# EAGLE design hail-debug (EAGLE 8.0.2)
AUTHOR: Brad Campbell; REV: A; TITLE: Hail Debug Board
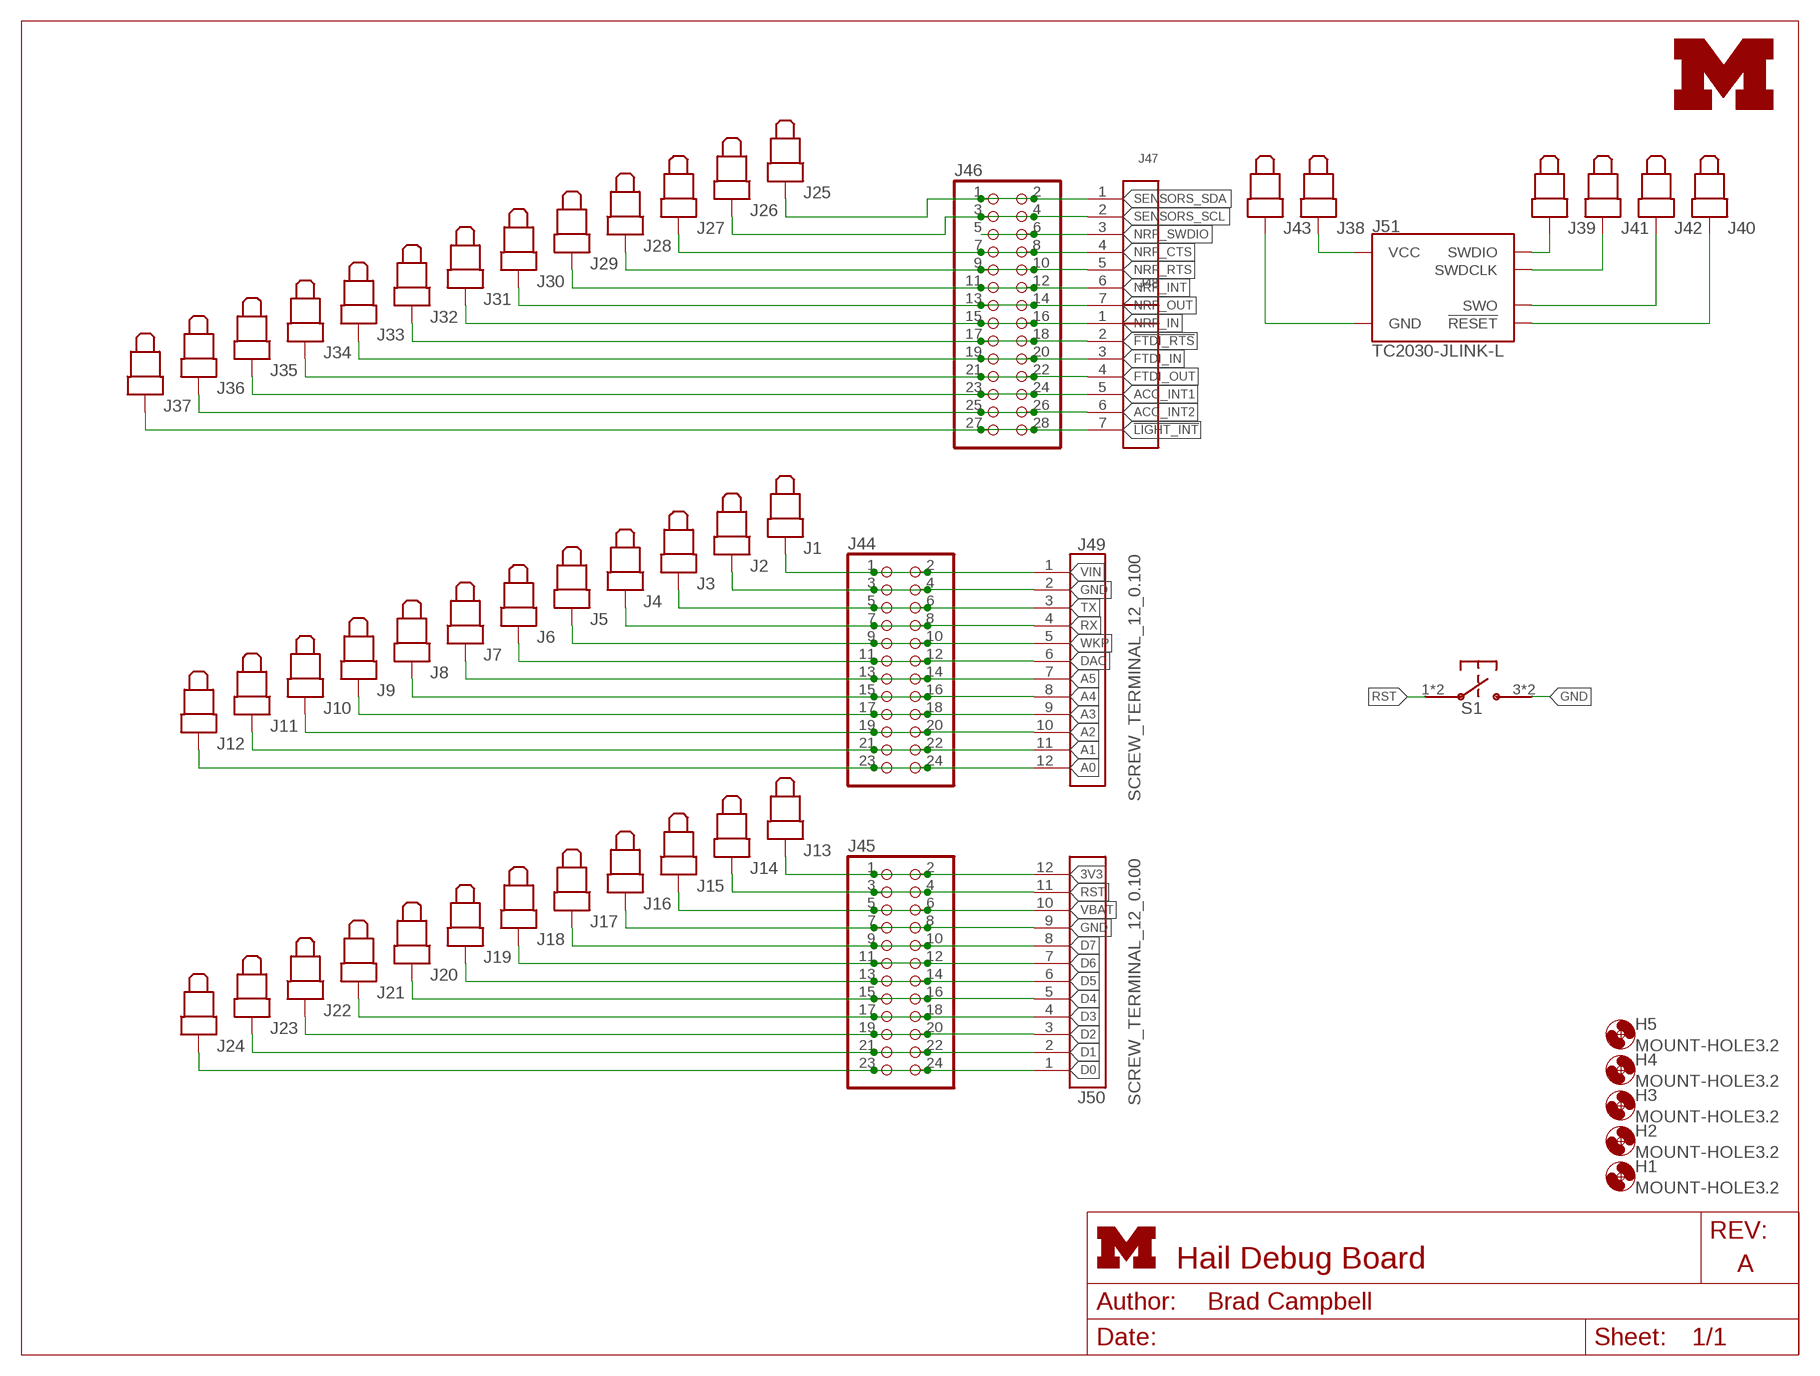
[diagram p0: schematic, sheet 1]
FRAME1 (LETTER_L_UMICH): HEIGHT: 8.5in; WIDTH: 11in

## Parts
H1  MOUNT-HOLE3.2  [3,2]
H2  MOUNT-HOLE3.2  [3,2]
H3  MOUNT-HOLE3.2  [3,2]
H4  MOUNT-HOLE3.2  [3,2]
H5  MOUNT-HOLE3.2  [3,2]
J1  MILLMAX_0908-X-15-20-75-14-11-0  [POGO_0908-X-15-20-75-14-11-0]
J2  MILLMAX_0908-X-15-20-75-14-11-0  [POGO_0908-X-15-20-75-14-11-0]
J3  MILLMAX_0908-X-15-20-75-14-11-0  [POGO_0908-X-15-20-75-14-11-0]
J4  MILLMAX_0908-X-15-20-75-14-11-0  [POGO_0908-X-15-20-75-14-11-0]
J5  MILLMAX_0908-X-15-20-75-14-11-0  [POGO_0908-X-15-20-75-14-11-0]
J6  MILLMAX_0908-X-15-20-75-14-11-0  [POGO_0908-X-15-20-75-14-11-0]
J7  MILLMAX_0908-X-15-20-75-14-11-0  [POGO_0908-X-15-20-75-14-11-0]
J8  MILLMAX_0908-X-15-20-75-14-11-0  [POGO_0908-X-15-20-75-14-11-0]
J9  MILLMAX_0908-X-15-20-75-14-11-0  [POGO_0908-X-15-20-75-14-11-0]
J10  MILLMAX_0908-X-15-20-75-14-11-0  [POGO_0908-X-15-20-75-14-11-0]
J11  MILLMAX_0908-X-15-20-75-14-11-0  [POGO_0908-X-15-20-75-14-11-0]
J12  MILLMAX_0908-X-15-20-75-14-11-0  [POGO_0908-X-15-20-75-14-11-0]
J13  MILLMAX_0908-X-15-20-75-14-11-0  [POGO_0908-X-15-20-75-14-11-0]
J14  MILLMAX_0908-X-15-20-75-14-11-0  [POGO_0908-X-15-20-75-14-11-0]
J15  MILLMAX_0908-X-15-20-75-14-11-0  [POGO_0908-X-15-20-75-14-11-0]
J16  MILLMAX_0908-X-15-20-75-14-11-0  [POGO_0908-X-15-20-75-14-11-0]
J17  MILLMAX_0908-X-15-20-75-14-11-0  [POGO_0908-X-15-20-75-14-11-0]
J18  MILLMAX_0908-X-15-20-75-14-11-0  [POGO_0908-X-15-20-75-14-11-0]
J19  MILLMAX_0908-X-15-20-75-14-11-0  [POGO_0908-X-15-20-75-14-11-0]
J20  MILLMAX_0908-X-15-20-75-14-11-0  [POGO_0908-X-15-20-75-14-11-0]
J21  MILLMAX_0908-X-15-20-75-14-11-0  [POGO_0908-X-15-20-75-14-11-0]
J22  MILLMAX_0908-X-15-20-75-14-11-0  [POGO_0908-X-15-20-75-14-11-0]
J23  MILLMAX_0908-X-15-20-75-14-11-0  [POGO_0908-X-15-20-75-14-11-0]
J24  MILLMAX_0908-X-15-20-75-14-11-0  [POGO_0908-X-15-20-75-14-11-0]
J25  MILLMAX_0985-X-15-20-71-14-11-0  [POGO_0985-X-15-20-71-14-11-0]
J26  MILLMAX_0985-X-15-20-71-14-11-0  [POGO_0985-X-15-20-71-14-11-0]
J27  MILLMAX_0985-X-15-20-71-14-11-0  [POGO_0985-X-15-20-71-14-11-0]
J28  MILLMAX_0985-X-15-20-71-14-11-0  [POGO_0985-X-15-20-71-14-11-0]
J29  MILLMAX_0985-X-15-20-71-14-11-0  [POGO_0985-X-15-20-71-14-11-0]
J30  MILLMAX_0985-X-15-20-71-14-11-0  [POGO_0985-X-15-20-71-14-11-0]
J31  MILLMAX_0985-X-15-20-71-14-11-0  [POGO_0985-X-15-20-71-14-11-0]
J32  MILLMAX_0985-X-15-20-71-14-11-0  [POGO_0985-X-15-20-71-14-11-0]
J33  MILLMAX_0985-X-15-20-71-14-11-0  [POGO_0985-X-15-20-71-14-11-0]
J34  MILLMAX_0985-X-15-20-71-14-11-0  [POGO_0985-X-15-20-71-14-11-0]
J35  MILLMAX_0985-X-15-20-71-14-11-0  [POGO_0985-X-15-20-71-14-11-0]
J36  MILLMAX_0985-X-15-20-71-14-11-0  [POGO_0985-X-15-20-71-14-11-0]
J37  MILLMAX_0985-X-15-20-71-14-11-0  [POGO_0985-X-15-20-71-14-11-0]
J38  MILLMAX_0985-X-15-20-71-14-11-0  [POGO_0985-X-15-20-71-14-11-0]
J39  MILLMAX_0985-X-15-20-71-14-11-0  [POGO_0985-X-15-20-71-14-11-0]
J40  MILLMAX_0985-X-15-20-71-14-11-0  [POGO_0985-X-15-20-71-14-11-0]
J41  MILLMAX_0985-X-15-20-71-14-11-0  [POGO_0985-X-15-20-71-14-11-0]
J42  MILLMAX_0985-X-15-20-71-14-11-0  [POGO_0985-X-15-20-71-14-11-0]
J43  MILLMAX_0985-X-15-20-71-14-11-0  [POGO_0985-X-15-20-71-14-11-0]
J44  PINHD-2X12  [2X12]
J45  PINHD-2X12  [2X12]
J46  PINHD-2X14  [2X14]
J47  SCREW-TERMINAL_7_0.100  [CONN_BLOCK_7]
J48  SCREW-TERMINAL_7_0.100  [CONN_BLOCK_7]
J49  SCREW_TERMINAL_12_0.100  [CONN_BLOCK_12]
J50  SCREW_TERMINAL_12_0.100  [CONN_BLOCK_12]
J51  TC2030-JLINK-L  [TC2030-IDC]
LOGO1  UMICH_SOLID_SMALL+  [UMICH_SOLID_100MIL]
S1  PTS645SM43SMTR92  [PTS645]

## Nets
3V3: J13.P$1 J45.1 J45.2 J50.12
!FTDI_RTS: J32.P1 J46.17 J46.18 J48.2
!LIGHT_INT: J37.P1 J46.27 J46.28 J48.7
!NRF_RESET: J40.P1 J51.3(!RESET)
A0: J12.P$1 J44.23 J44.24 J49.12
A1: J11.P$1 J44.21 J44.22 J49.11
A2: J10.P$1 J44.19 J44.20 J49.10
A3: J9.P$1 J44.17 J44.18 J49.9
A4: J8.P$1 J44.15 J44.16 J49.8
A5: J7.P$1 J44.13 J44.14 J49.7
ACC_INT1: J35.P1 J46.23 J46.24 J48.5
ACC_INT2: J36.P1 J46.25 J46.26 J48.6
D0: J24.P$1 J45.23 J45.24 J50.1
D1: J23.P$1 J45.21 J45.22 J50.2
D2: J22.P$1 J45.19 J45.20 J50.3
D3: J21.P$1 J45.17 J45.18 J50.4
D4: J20.P$1 J45.15 J45.16 J50.5
D5: J19.P$1 J45.13 J45.14 J50.6
D6: J18.P$1 J45.11 J45.12 J50.7
D7: J17.P$1 J45.9 J45.10 J50.8
DAC: J6.P$1 J44.11 J44.12 J49.6
FTDI_IN: J33.P1 J46.19 J46.20 J48.3
FTDI_OUT: J34.P1 J46.21 J46.22 J48.4
GND: J2.P$1 J16.P$1 J43.P1 J44.3 J44.4 J45.7 J45.8 J49.2 J50.9 J51.5(GND) S1.3 S1.4
NRF_CTS: J27.P1 J46.7 J46.8 J47.4
NRF_IN: J31.P1 J46.15 J46.16 J48.1
NRF_INT: J29.P1 J46.11 J46.12 J47.6
NRF_OUT: J30.P1 J46.13 J46.14 J47.7
NRF_RTS: J28.P1 J46.9 J46.10 J47.5
NRF_SWDCLK: J41.P1 J51.4(SWDCLK)
NRF_SWDIO: J39.P1 J46.5 J46.6 J47.3 J51.2(SWDIO)
NRF_SWO: J42.P1
NRV_VCC: J38.P1 J51.1(VCC)
RST: J14.P$1 J45.3 J45.4 J50.11 S1.1 S1.2
RX: J4.P$1 J44.7 J44.8 J49.4
SENSORS_SCL: J26.P1 J46.3 J46.4 J47.2
SENSORS_SDA: J25.P1 J46.1 J46.2 J47.1
TX: J3.P$1 J44.5 J44.6 J49.3
VBAT: J15.P$1 J45.5 J45.6 J50.10
VIN: J1.P$1 J44.1 J44.2 J49.1
WKP: J5.P$1 J44.9 J44.10 J49.5
Unconnected: J51.6(SWO)

## Library data of the parts
H1-H5 = holes:MOUNT-HOLE: MOUNTING HOLE with drill center marker
J1-J24 = headers:MILLMAX_0908-X-15-20-75-14-11-0; DIGIKEY: ED90384-ND
J25-J43 = headers:MILLMAX_0985-X-15-20-71-14-11-0; DIGIKEY: ED1122-ND
J44 J45 = pinhead:PINHD-2X12: PIN HEADER; DIGIKEY: S2011EC-12-ND
J46 = pinhead:PINHD-2X14: PIN HEADER; DIGIKEY: S2011EC-14-ND
J47 J48 = headers:SCREW-TERMINAL_7_0.100: 7x 0.100 in screw terminal block; DIGIKEY: 277-1278-ND; MOUSER: 651-1725708; NEWARK: 14X4980
J49 J50 = headers:SCREW_TERMINAL_12_0.100; DIGIKEY: 277-1283-ND
J51 = connector:TC2030-JLINK
LOGO1 = logos:UMICH_SOLID
S1 = switches:PTS645SM43SMTR92: Tactile Switch SPST-NO Top Actuated Surface Mount; DIGIKEY: CKN9112CT-ND

## Board
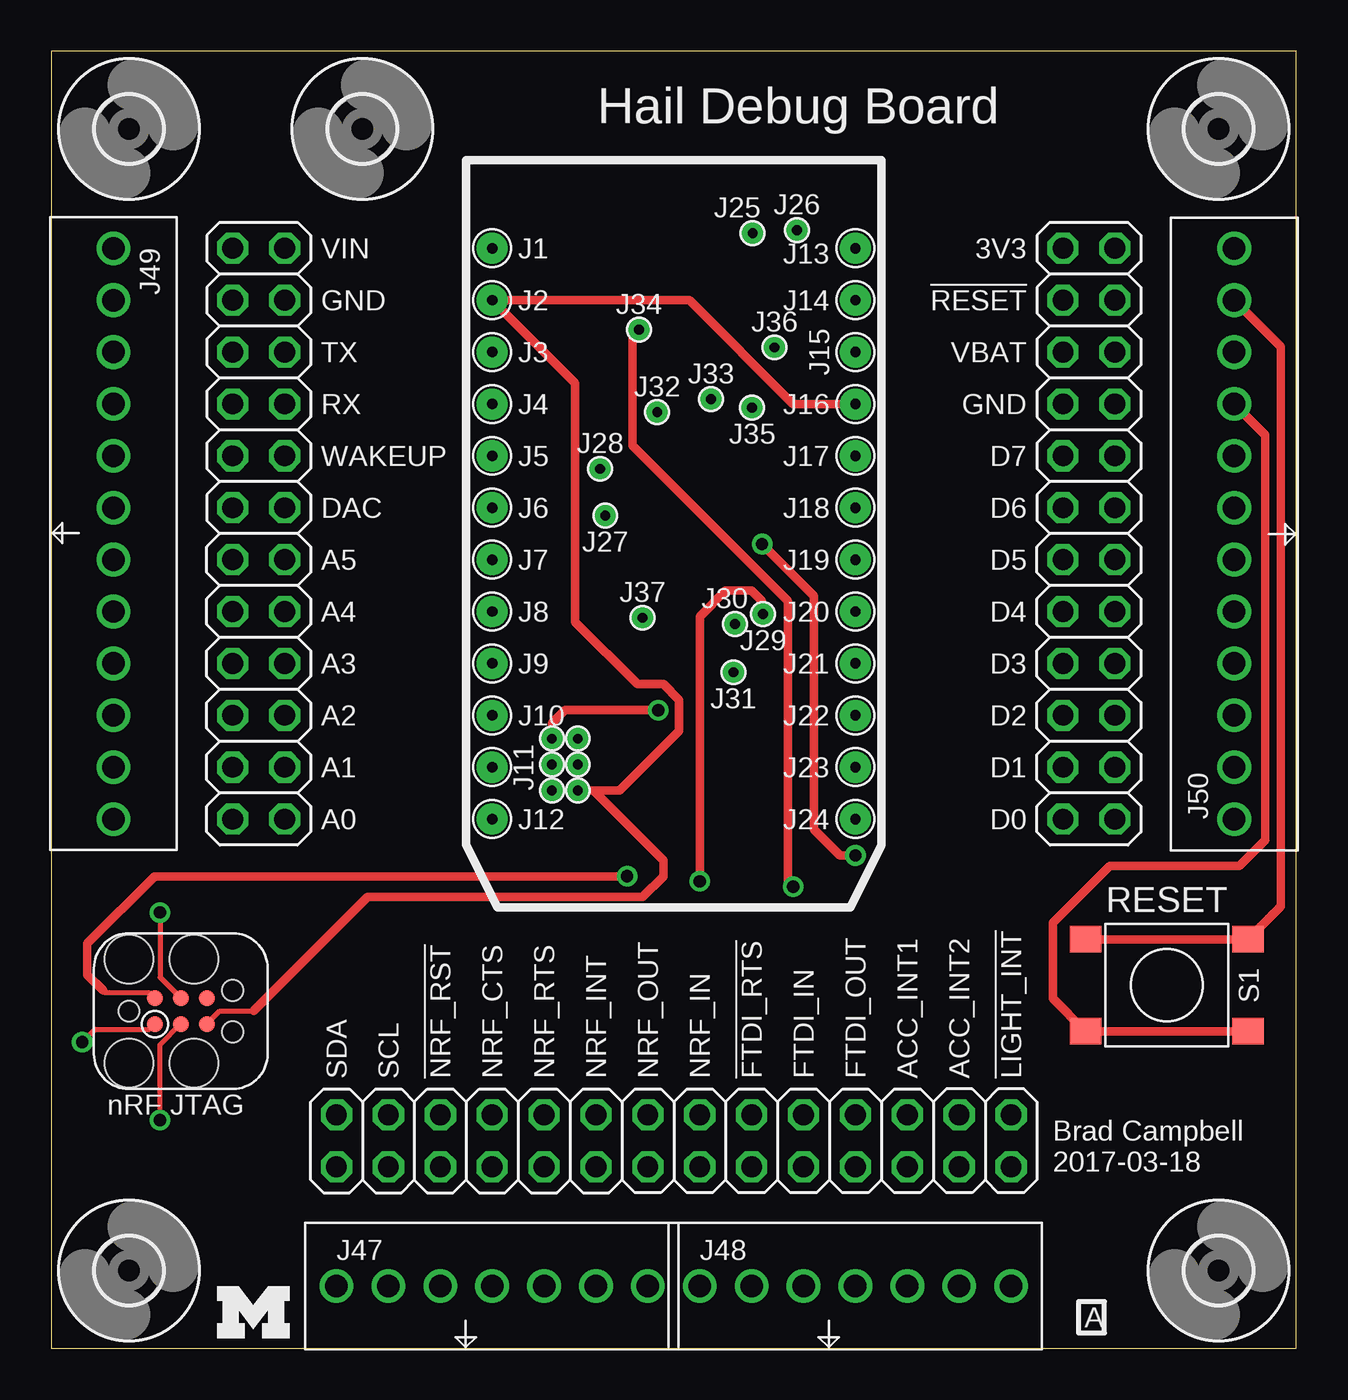
[diagram p1: board, top side]
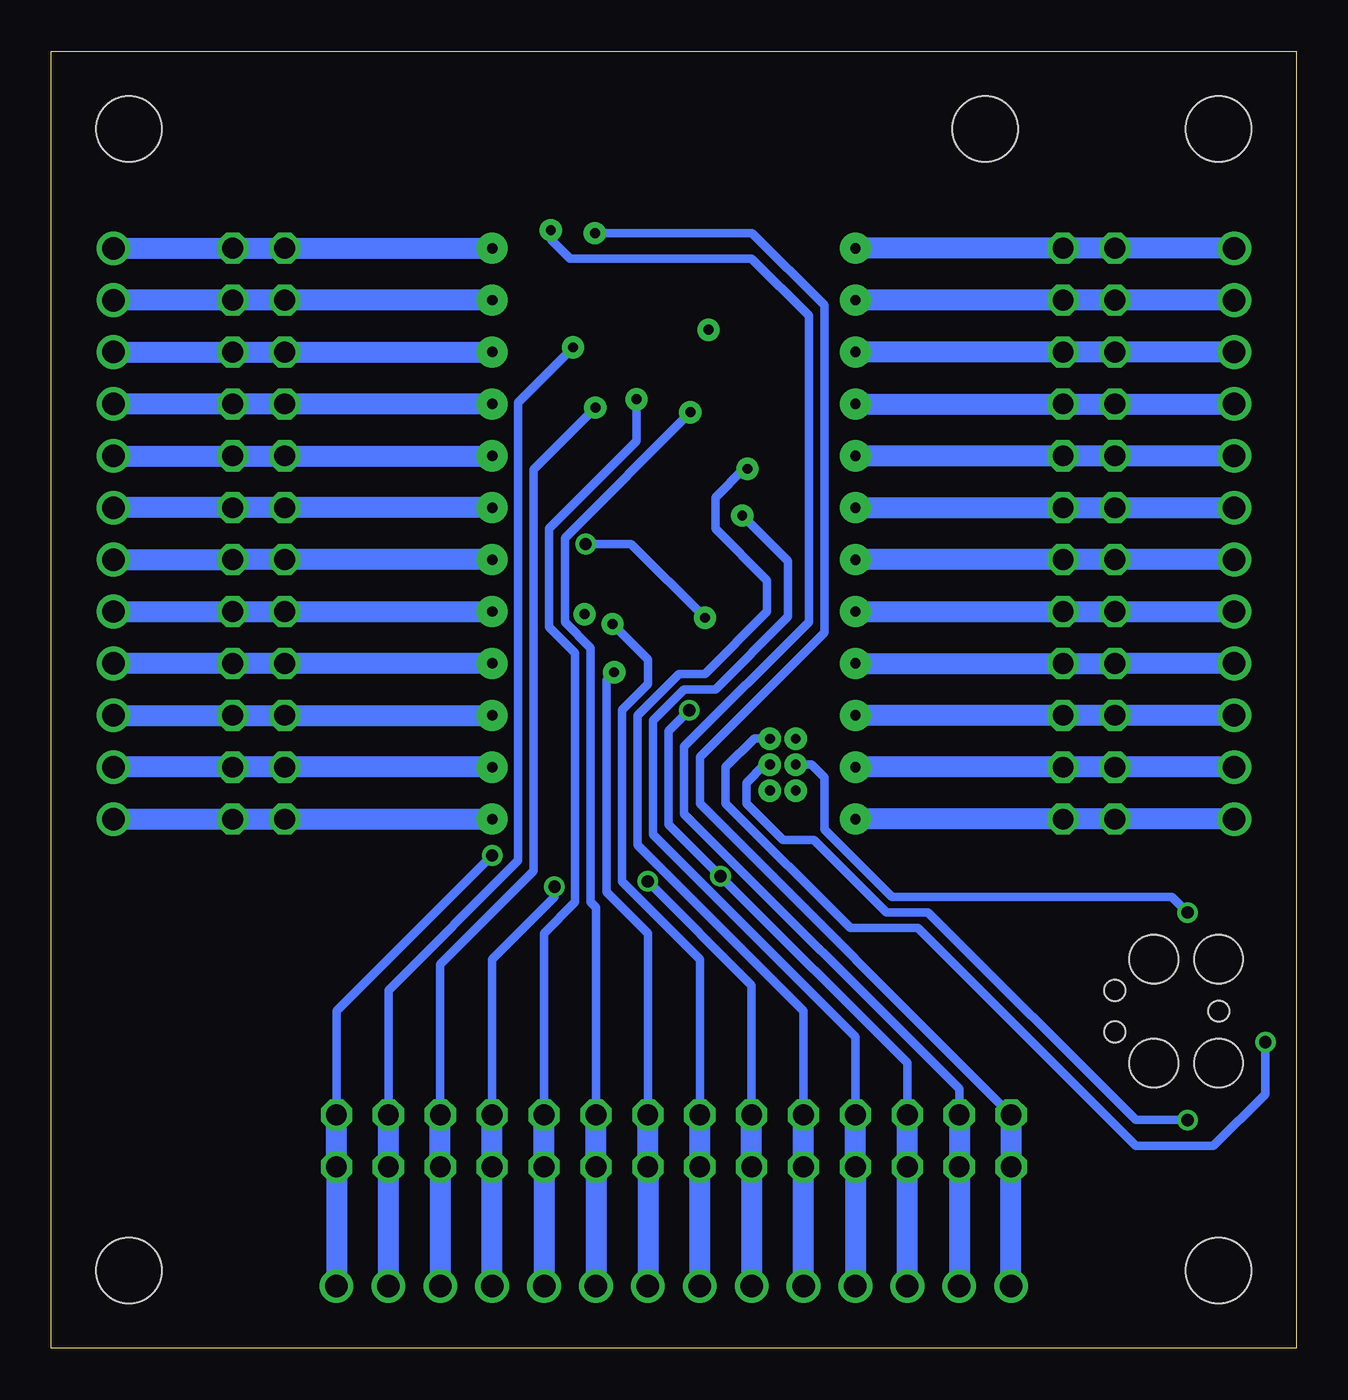
[diagram p2: board, bottom side, seen from below]

Size 60.96 x 63.5 mm. Coordinates in mm from the lower left corner, seen from the top.
Outline: 0,0 60.96,0 60.96,63.5 0,63.5 0,0
Copper layers (1*16): Top 0.0178mm / dielectric 59mil / Bottom 0.0178mm
Design rules "sunstone-2lyr_v1.0.0.3": minimum track width 6mil, minimum drill 14mil, track to track 6mil, track to pad 6mil, pad to pad 6mil, via to via 6mil, smd to smd 6mil, copper to edge 20mil, drill to drill 16mil, minimum pad ring 8mil, minimum via ring 8mil, stop-mask expansion 3mil, vias tented up to drill 50mil, thermal gap 10mil

### Footprints (pad centres in the part's own frame; a part is rotated, then mirrored left to right if it is on the bottom)
3,2 = hole 3.2: 0,0
POGO_0908-X-15-20-75-14-11-0 = drill 0.508 pad 1.524: P$1 0,0
POGO_0985-X-15-20-71-14-11-0 = drill 0.483 pad 1.092: P1 0,0
2X12 = drill 1.016 octagon: 1 -13.97,-1.27; 2 -13.97,1.27; 3 -11.43,-1.27; 4 -11.43,1.27; 5 -8.89,-1.27; 6 -8.89,1.27; 7 -6.35,-1.27; 8 -6.35,1.27; 9 -3.81,-1.27; 10 -3.81,1.27; 11 -1.27,-1.27; 12 -1.27,1.27; 13 1.27,-1.27; 14 1.27,1.27; 15 3.81,-1.27; 16 3.81,1.27; 17 6.35,-1.27; 18 6.35,1.27; 19 8.89,-1.27; 20 8.89,1.27; 21 11.43,-1.27; 22 11.43,1.27; 23 13.97,-1.27; 24 13.97,1.27
2X14 = drill 1.016 octagon: 1 -16.51,-1.27; 2 -16.51,1.27; 3 -13.97,-1.27; 4 -13.97,1.27; 5 -11.43,-1.27; 6 -11.43,1.27; 7 -8.89,-1.27; 8 -8.89,1.27; 9 -6.35,-1.27; 10 -6.35,1.27; 11 -3.81,-1.27; 12 -3.81,1.27; 13 -1.27,-1.27; 14 -1.27,1.27; 15 1.27,-1.27; 16 1.27,1.27; 17 3.81,-1.27; 18 3.81,1.27; 19 6.35,-1.27; 20 6.35,1.27; 21 8.89,-1.27; 22 8.89,1.27; 23 11.43,-1.27; 24 11.43,1.27; 25 13.97,-1.27; 26 13.97,1.27; 27 16.51,-1.27; 28 16.51,1.27
CONN_BLOCK_7 = drill 1.1: 1 -7.62,0; 2 -5.08,0; 3 -2.54,0; 4 0,0; 5 2.54,0; 6 5.08,0; 7 7.62,0
CONN_BLOCK_12 = drill 1.1: 1 -13.97,0; 2 -11.43,0; 3 -8.89,0; 4 -6.35,0; 5 -3.81,0; 6 -1.27,0; 7 1.27,0; 8 3.81,0; 9 6.35,0; 10 8.89,0; 11 11.43,0; 12 13.97,0
TC2030-IDC = smd 0.787 x 0.787: 1 -1.27,-0.635; 2 -1.27,0.635; 3 0,-0.635; 4 0,0.635; 5 1.27,-0.635; 6 1.27,0.635 | hole 2.375: -2.54,2.54; 0.635,2.54; 0.635,-2.54; -2.54,-2.54 | hole 1.016: -2.54,0; 2.54,1.016; 2.54,-1.016
PTS645 = smd 1.55 x 1.3: 1 -3.975,2.25; 2 3.975,2.25; 3 3.975,-2.25; 4 -3.975,-2.25

### Placement (x,y rotation side)
H1  3.81,59.69 0 top
H2  57.15,59.69 0 top
H3  57.15,3.81 0 top
H4  3.81,3.81 0 top
H5  15.24,59.69 0 top
J1  21.59,53.85 0 top
J2  21.59,51.31 0 top
J3  21.59,48.77 0 top
J4  21.59,46.23 0 top
J5  21.59,43.69 0 top
J6  21.59,41.15 0 top
J7  21.59,38.61 0 top
J8  21.59,36.07 0 top
J9  21.59,33.53 0 top
J10  21.59,30.99 0 top
J11  21.59,28.45 0 top
J12  21.59,25.91 0 top
J13  39.37,53.85 0 top
J14  39.37,51.31 0 top
J15  39.37,48.77 0 top
J16  39.37,46.23 0 top
J17  39.37,43.69 0 top
J18  39.37,41.15 0 top
J19  39.37,38.61 0 top
J20  39.37,36.07 0 top
J21  39.37,33.53 0 top
J22  39.37,30.99 0 top
J23  39.37,28.45 0 top
J24  39.37,25.91 0 top
J25  34.34,54.58 0 top
J26  36.5,54.74 0 top
J27  27.13,40.77 0 top
J28  26.87,43.05 0 top
J29  34.85,35.94 0 top
J30  33.48,35.46 0 top
J31  33.4,33.1 0 top
J32  29.67,45.82 0 top
J33  32.31,46.46 0 top
J34  28.78,49.86 0 top
J35  34.32,46.05 0 top
J36  35.41,49 0 top
J37  28.96,35.76 0 top
J38  25.78,29.84 0 top
J39  24.51,29.84 0 top
J40  25.78,28.57 0 top
J41  24.51,28.57 0 top
J42  24.51,27.3 0 top
J43  25.78,27.3 0 top
J44  10.16,39.88 270 top
J45  50.8,39.88 270 top
J46  30.48,10.16 0 top
J47  21.59,3.05 0 top
J48  39.37,3.05 0 top
J49  3.05,39.88 270 top
J50  57.91,39.88 90 top
J51  6.35,16.51 0 top
LOGO1  8.13,0.51 0 top
S1  54.61,17.78 0 top

### Tracks (layer width: path | path; a pad name or v marks a point on that pad's centre or on a via)
3V3
  Bottom 1.016: J50.12 J45.2 J45.1 J13.P$1
!FTDI_RTS
  Bottom 0.406: J46.18 34.29,21.59 34.54,21.84 34.54,34.29 35.81,35.56 35.81,39.67 J32.P1
  Bottom 1.016: J48.2 J46.17 J46.18
!LIGHT_INT  (via drill 0.6)
  Top 0.406: v39.37,24.13 38.61,24.13 37.34,25.4 37.34,36.83 v34.8,39.37
  Bottom 0.406: J46.28 46.99,16.51 v39.37,24.13 | v34.8,39.37 32.56,39.37 J37.P1
  Bottom 1.016: J46.28 J46.27 J48.7
!NRF_RESET  (via drill 0.6)
  Top 0.254: J51.3 5.33,14.86 v5.33,11.18
  Bottom 0.406: J40.P1 26.04,28.57 26.92,27.69 26.92,26.67 25.15,24.89 23.62,24.89 20.07,21.34 18.03,21.34 7.87,11.18 v5.33,11.18
A0
  Bottom 1.016: J12.P$1 J44.24 J44.23 J49.12
A1
  Bottom 1.016: J11.P$1 J44.22 J44.21 J49.11
A2
  Bottom 1.016: J10.P$1 J44.20 J44.19 J49.10
A3
  Bottom 1.016: J49.9 J44.17 J44.18 J9.P$1
A4
  Bottom 1.016: J8.P$1 J44.16 J44.15 J49.8
A5
  Bottom 1.016: J49.7 J44.13 J44.14 J7.P$1
ACC_INT1
  Bottom 0.406: J46.24 41.91,18.8 37.34,23.37 37.34,43.03 J35.P1
  Bottom 1.016: J46.24 J46.23 J48.5
ACC_INT2
  Bottom 0.406: J46.26 44.45,17.53 38.1,23.88 38.1,46.3 J36.P1
  Bottom 1.016: J48.6 J46.25 J46.26
D0
  Bottom 1.016: J24.P$1 J45.23 J45.24 J50.1
D1
  Bottom 1.016: J23.P$1 J45.21 J45.22 J50.2
D2
  Bottom 1.016: J22.P$1 J45.19 J45.20 J50.3
D3
  Bottom 1.016: J21.P$1 J45.17 J45.18 J50.4
D4
  Bottom 1.016: J20.P$1 J45.15 J45.16 J50.5
D5
  Bottom 1.016: J50.6 J45.14 J45.13 J19.P$1
D6
  Bottom 1.016: J18.P$1 J45.11 J45.12 J50.7
D7
  Bottom 1.016: J50.8 J45.10 J45.9 J17.P$1
DAC
  Bottom 1.016: J6.P$1 J44.12 J44.11 J49.6
FTDI_IN
  Bottom 0.406: J46.20 36.83,20.32 35.31,21.84 35.31,34.04 36.58,35.31 36.58,40.13 32.31,44.4 J33.P1
  Bottom 1.016: J46.20 J46.19 J48.3
FTDI_OUT  (via drill 0.6)
  Top 0.406: J34.P1 28.45,49.53 28.45,44.2 36.07,36.58 36.07,22.86 v36.32,22.61
  Bottom 0.406: J46.22 39.37,19.05 36.32,22.1 v36.32,22.61
  Bottom 1.016: J48.4 J46.21 J46.22
GND
  Top 0.254: J51.5 8.26,16.51 9.91,16.51
  Top 0.406: S1.3 S1.4 49.02,17.14 49.02,20.83 51.82,23.62 58.17,23.62 59.44,24.89 59.44,44.7 J50.9 | J16.P$1 36.32,46.23 31.24,51.31 J2.P$1 25.65,47.24 25.65,35.56 28.7,32.51 29.97,32.51 30.73,31.75 30.73,30.23 27.81,27.3 26.54,27.3 | 9.91,16.51 15.49,22.1 28.96,22.1 29.97,23.11 29.97,23.88 26.54,27.3 | 26.54,27.3 J43.P1
  Bottom 1.016: J49.2 J44.3 J44.4 J2.P$1 | J16.P$1 J45.7 J45.8 J50.9
NRF_CTS
  Bottom 0.406: J46.8 21.59,15.24 31.5,25.15 31.5,30.73 29.97,32.26 28.45,32.26 24.89,35.81 24.89,38.53 J27.P1
  Bottom 1.016: J46.8 J46.7 J47.4
NRF_IN
  Bottom 0.406: J46.16 31.75,20.32 33.78,22.35 33.78,32.72 J31.P1
  Bottom 1.016: J46.16 J46.15 J48.1
NRF_INT  (via drill 0.6)
  Top 0.406: v31.75,22.86 31.75,35.81 33.02,37.08 34.29,37.08 34.8,36.58 34.8,35.99 J29.P1
  Bottom 0.406: J46.12 26.67,17.78 v31.75,22.86
  Bottom 1.016: J46.12 J46.11 J47.6
NRF_OUT
  Bottom 0.406: J46.14 29.21,19.05 33.02,22.86 33.02,31.24 31.75,32.51 31.75,33.73 J30.P1
  Bottom 1.016: J47.7 J46.13 J46.14
NRF_RTS
  Bottom 0.406: J46.10 24.13,16.51 32.26,24.64 32.26,30.99 30.23,33.02 28.96,33.02 25.91,36.07 25.91,37.59 28.45,40.13 28.45,41.66 27.05,43.05 J28.P1
  Bottom 1.016: J47.5 J46.9 J46.10
NRF_SWDCLK  (via drill 0.6)
  Top 0.254: v5.33,21.34 5.33,18.16 J51.4
  Bottom 0.406: J41.P1 23.75,28.57 23.11,27.94 23.11,25.4 19.81,22.1 6.1,22.1 v5.33,21.34
NRF_SWDIO  (via drill 0.6)
  Top 0.254: 2.54,17.53 2.64,17.42 4.8,17.42 J51.2
  Top 0.406: v29.72,31.24 25.15,31.24 24.51,30.61 J39.P1 | v28.19,23.11 5.08,23.11 1.78,19.81 1.78,18.29 2.54,17.53
  Bottom 0.406: J46.6 19.05,13.97 v28.19,23.11 30.73,25.65 30.73,30.23 v29.72,31.24
  Bottom 1.016: J47.3 J46.5 J46.6
NRV_VCC  (via drill 0.6)
  Top 0.254: v1.52,14.99 2.16,15.62 4.83,15.62 J51.1
  Bottom 0.406: J38.P1 26.54,29.84 27.94,28.45 27.94,26.67 21.84,20.57 18.54,20.57 7.87,9.91 4.06,9.91 1.52,12.45 v1.52,14.99
RST
  Top 0.406: S1.1 S1.2 60.2,21.64 60.2,49.02 J50.11
  Bottom 1.016: J14.P$1 J45.3 J45.4 J50.11
RX
  Bottom 1.016: J4.P$1 J44.8 J44.7 J49.4
SENSORS_SCL
  Bottom 0.406: J26.P1 36.5,54.28 35.56,53.34 26.67,53.34 23.88,50.55 23.88,35.56 29.97,29.46 29.97,26.16 16.51,12.7 J46.4
  Bottom 1.016: J46.4 J46.3 J47.2
SENSORS_SDA
  Bottom 0.406: J25.P1 26.64,54.58 23.11,51.05 23.11,35.05 29.21,28.96 29.21,26.67 J46.2
  Bottom 1.016: J47.1 J46.1 J46.2
TX
  Bottom 1.016: J49.3 J44.5 J44.6 J3.P$1
VBAT
  Bottom 1.016: J50.10 J45.6 J45.5 J15.P$1
VIN
  Bottom 1.016: J49.1 J44.1 J44.2 J1.P$1
WKP
  Bottom 1.016: J49.5 J44.9 J44.10 J5.P$1

### Text on the board
tPlace: Hail Debug Board | VIN | 3V3 | GND | !RESET | TX | VBAT | RX | GND | WAKEUP | D7 | DAC | D6 | A5 | D5 | A4 | D4 | A3 | D3 | A2 | D2 | A1 | D1 | A0 | D0 | RESET | SDA | SCL | !NRF_RST | NRF_CTS | NRF_RTS | NRF_INT | NRF_OUT | NRF_IN | !FTDI_RTS | FTDI_IN | FTDI_OUT | ACC_INT1 | ACC_INT2 | !LIGHT_INT | nRF JTAG | Brad Campbell / 2017-03-18 | A